# Altium schematic sheet Power.SchDoc
size A4
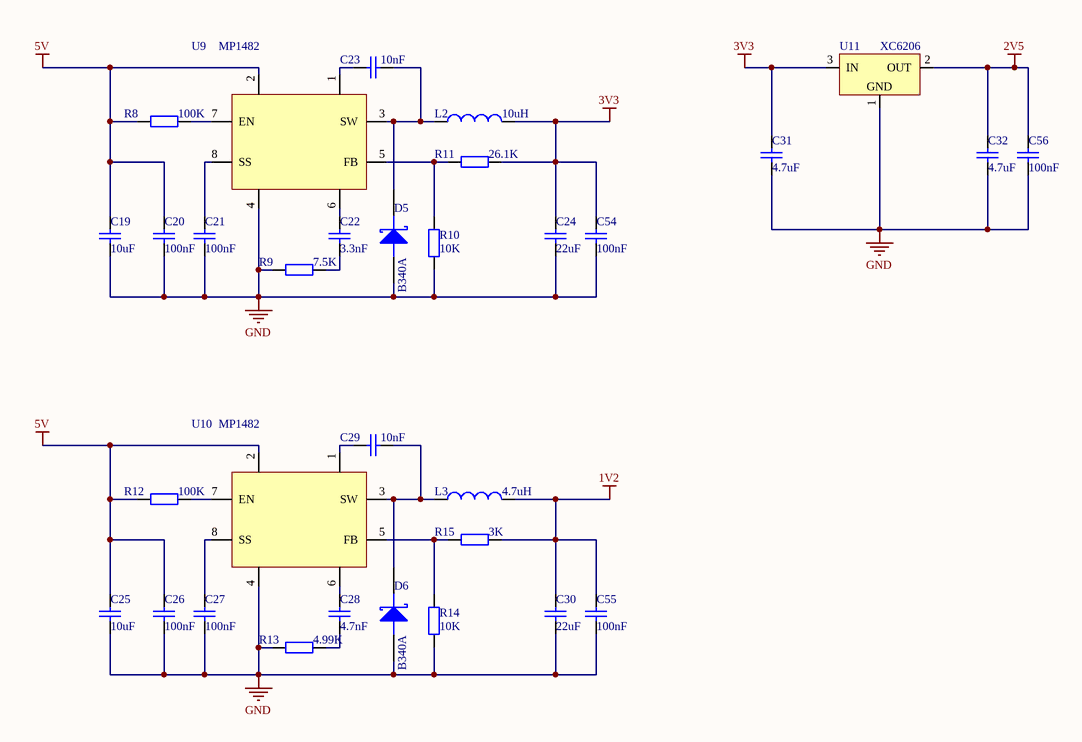
[diagram p0: Power.SchDoc]

## Parts
C19  10uF  [C1206]
C20  100nF  [C0603]
C21  100nF  [C0603]
C22  3.3nF  [C0603]
C23  10nF  [C0603]
C24  22uF  [C1206]
C25  10uF  [C1206]
C26  100nF  [C0603]
C27  100nF  [C0603]
C28  4.7nF  [C0603]
C29  10nF  [C0603]
C30  22uF  [C1206]
C31  4.7uF  [C0603]
C32  4.7uF  [C0603]
C54  100nF  [C0603]
C55  100nF  [C0603]
C56  100nF  [C0603]
D5  B340A  [SMA]
D6  B340A  [SMA]
L2  10uH  [CDRH5D28]
L3  4.7uH  [CDRH5D28]
R8  100K  [R0603]
R9  7.5K  [R0603]
R10  10K  [R0603]
R11  26.1K  [R0603]
R12  100K  [R0603]
R13  4.99K  [R0603]
R14  10K  [R0603]
R15  3K  [R0603]
U9  MP1482  [SOIC-8]
U10  MP1482  [SOIC-8]
U11  XC6206  [SOT-23]

## Nets
1V2: C30.1 C55.2 L3.2 R15.1
2V5: C32.2 C56.2 U11.2(OUT)
3V3: C24.1 C31.2 C54.2 L2.2 R11.1 U11.3(IN)
5V: C19.2 C20.2 C25.2 C26.2 R8.2 R12.2 U9.2(IN) U10.2(IN)
GND: C19.1 C20.1 C21.1 C24.2 C25.1 C26.1 C27.1 C30.2 C31.1 C32.1 C54.1 C55.1 C56.1 D5.1(A) D6.1(A) R9.2 R10.1 R13.2 R14.1 U9.4(GND) U10.4(GND) U11.1(GND)
NetC21_2: C21.2 U9.8(SS)
NetC22_1: C22.1 R9.1
NetC22_2: C22.2 U9.6(COMP)
NetC23_1: C23.1 D5.2(K) L2.1 U9.3(SW)
NetC23_2: C23.2 U9.1(BS)
NetC27_2: C27.2 U10.8(SS)
NetC28_1: C28.1 R13.1
NetC28_2: C28.2 U10.6(COMP)
NetC29_1: C29.1 D6.2(K) L3.1 U10.3(SW)
NetC29_2: C29.2 U10.1(BS)
NetR8_1: R8.1 U9.7(EN)
NetR10_2: R10.2 R11.2 U9.5(FB)
NetR12_1: R12.1 U10.7(EN)
NetR14_2: R14.2 R15.2 U10.5(FB)

## Library data of the parts
C19-C32 C54-C56 = Cap: Capacitor; Published: 8-Jun-2000; LatestRevisionDate: 17-Jul-2002; LatestRevisionNote: Re-released for DXP Platform.; PackageReference: RAD-0.3; Publisher: Altium Limited
D5 D6 = DIODE SCHOTTKY: Schottky Diode
L2 L3 = Inductor: Code_IEC: 1005; Published: 8-Jun-2000; LatestRevisionDate: 17-Jul-2002; LatestRevisionNote: Re-released for DXP Platform.; PackageReference: 0402-A; Publisher: Altium Limited; Code_JEITA: 0402
R8-R15 = Res2: Resistor; Published: 8-Jun-2000; LatestRevisionDate: 17-Jul-2002; LatestRevisionNote: Re-released for DXP Platform.; PackageReference: AXIAL-0.4; Publisher: Altium Limited
U11 = XC6206: LDO